# EAGLE schematic motor (EAGLE 9.7.0)
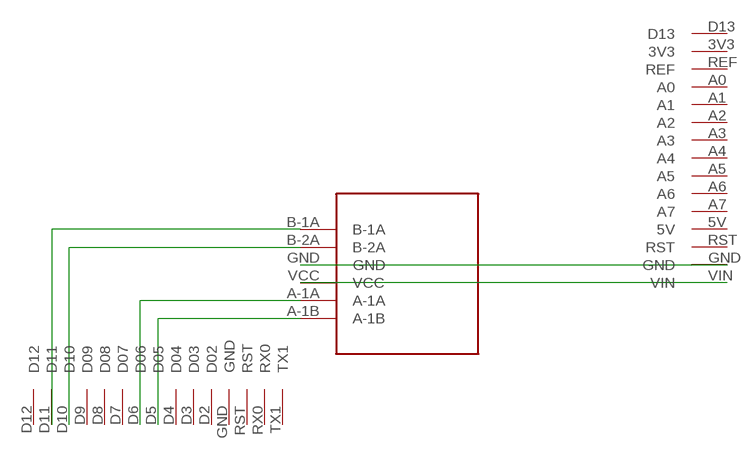
[diagram p0: schematic, sheet 1]

## Parts
U$1  ARDUINO-NANO-JUMPER-1  [ARDUINO-NANO-JUMPER-1]
U$2  L9110S  [L9100S]
U$7  ARDUINO-NANO-JUMPER-2  [ARDUINO-NANO-JUMPER-2]

## Nets
D05: U$1.D5(D05) U$2.A-1B
D06: U$1.D6(D06) U$2.A-1A
GND: U$2.GND U$7.GND
N$3: U$1.D11 U$2.B-1A
N$4: U$1.D10 U$2.B-2A
VIN: U$2.VCC U$7.VIN
Unconnected: U$1.D2(D02) U$1.D3(D03) U$1.D4(D04) U$1.D7(D07) U$1.D8(D08) U$1.D9(D09) U$1.D12 U$1.GND U$1.RST U$1.RX0 U$1.TX1 U$7.3V3 U$7.5V U$7.A0 U$7.A1 U$7.A2 U$7.A3 U$7.A4 U$7.A5 U$7.A6 U$7.A7 U$7.D13 U$7.REF U$7.RST

## Library data of the parts
U$1 = RC Car:ARDUINO-NANO-JUMPER-1
U$2 = RC Car:L9110S
U$7 = RC Car:ARDUINO-NANO-JUMPER-2